# EAGLE schematic iot1 (EAGLE 9.6.2)

## Sheet 1 of 5
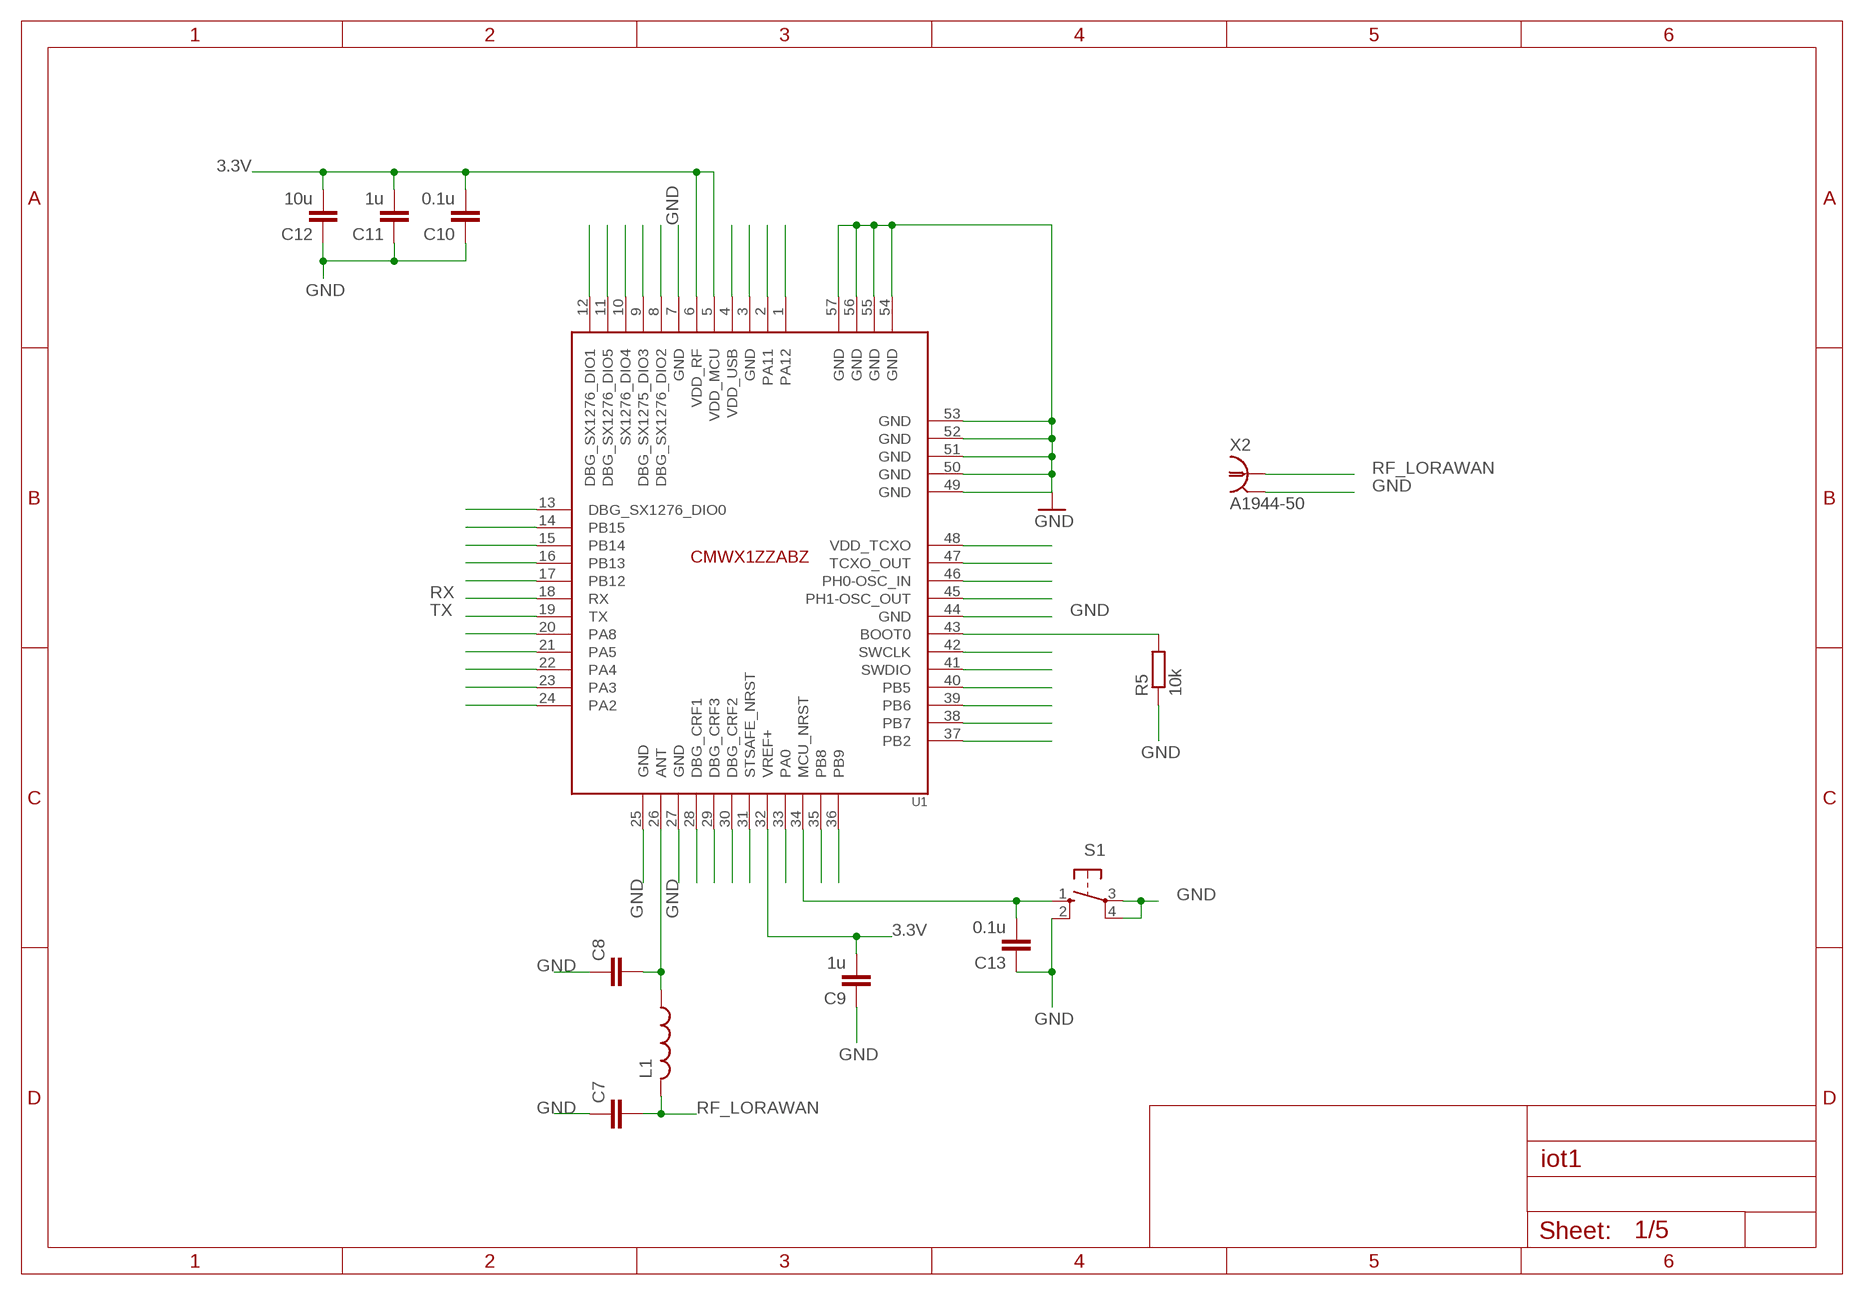
[diagram p0: schematic, sheet 1]

### Parts
C7  C-EU050-025X075  [C050-025X075]
C8  C-EU050-025X075  [C050-025X075]
C9  1u  C-EU050-025X075  [C050-025X075]
C10  0.1u  C-EU050-025X075  [C050-025X075]
C11  1u  C-EU050-025X075  [C050-025X075]
C12  10u  C-EU050-025X075  [C050-025X075]
C13  0.1u  C-EU050-025X075  [C050-025X075]
L1  L-US0207/7  [0207/7]
R5  10k  R-EU_0204/5  [0204/5]
S1  10-XX  [B3F-10XX]
U1  CMWX1ZZABZ  [CMWX1ZZABZ]
X2  A1944-50  [A1944]

### Nets
3.3V: C9.2 C10.2 C11.2 C12.2 U1.5(VDD_MCU) U1.6(VDD_RF) U1.32(VREF+) ; also sheet 2,4
GND: C7.1 C8.1 C9.1 C10.1 C11.1 C12.1 C13.1 R5.1 S1.2(S1) S1.3(P) S1.4(P1) U1.7(GND) U1.25(GND) U1.27(GND) U1.44(GND) U1.49(GND) U1.50(GND) U1.51(GND) U1.52(GND) U1.53(GND) U1.54(GND) U1.55(GND) U1.56(GND) U1.57(GND) X2.2 X2.3 X2.4 X2.5 ; also sheet 2,3,4,5
N$1: U1.12(DBG_SX1276_DIO1)
N$2: U1.11(DBG_SX1276_DIO5)
N$3: U1.10(SX1276_DIO4)
N$4: U1.9(DBG_SX1275_DIO3)
N$5: U1.8(DBG_SX1276_DIO2)
N$6: U1.4(VDD_USB)
N$10: U1.3(GND)
N$11: U1.2(PA11)
N$12: U1.1(PA12)
N$17: U1.13(DBG_SX1276_DIO0)
N$18: U1.14(PB15)
N$19: U1.15(PB14)
N$20: U1.16(PB13)
N$21: U1.17(PB12)
N$24: U1.20(PA8)
N$25: U1.21(PA5)
N$26: U1.22(PA4)
N$27: U1.23(PA3)
N$28: U1.24(PA2)
N$30: C8.2 L1.1 U1.26(ANT)
N$32: U1.28(DBG_CRF1)
N$33: U1.29(DBG_CRF3)
N$34: U1.30(DBG_CRF2)
N$35: U1.31(STSAFE_NRST)
N$37: U1.33(PA0)
N$38: C13.2 S1.1(S) U1.34(MCU_NRST)
N$39: U1.35(PB8)
N$40: U1.36(PB9)
N$46: U1.48(VDD_TCXO)
N$47: U1.47(TCXO_OUT)
N$48: U1.46(PH0-OSC_IN)
N$49: U1.45(PH1-OSC_OUT)
N$51: R5.2 U1.43(BOOT0)
N$52: U1.42(SWCLK)
N$53: U1.41(SWDIO)
N$54: U1.40(PB5)
N$55: U1.39(PB6)
N$56: U1.38(PB7)
N$57: U1.37(PB2)
RF_LORAWAN: C7.2 L1.2 X2.1
RX: U1.18(RX) ; also sheet 3
TX: U1.19(TX) ; also sheet 3

## Sheet 2 of 5
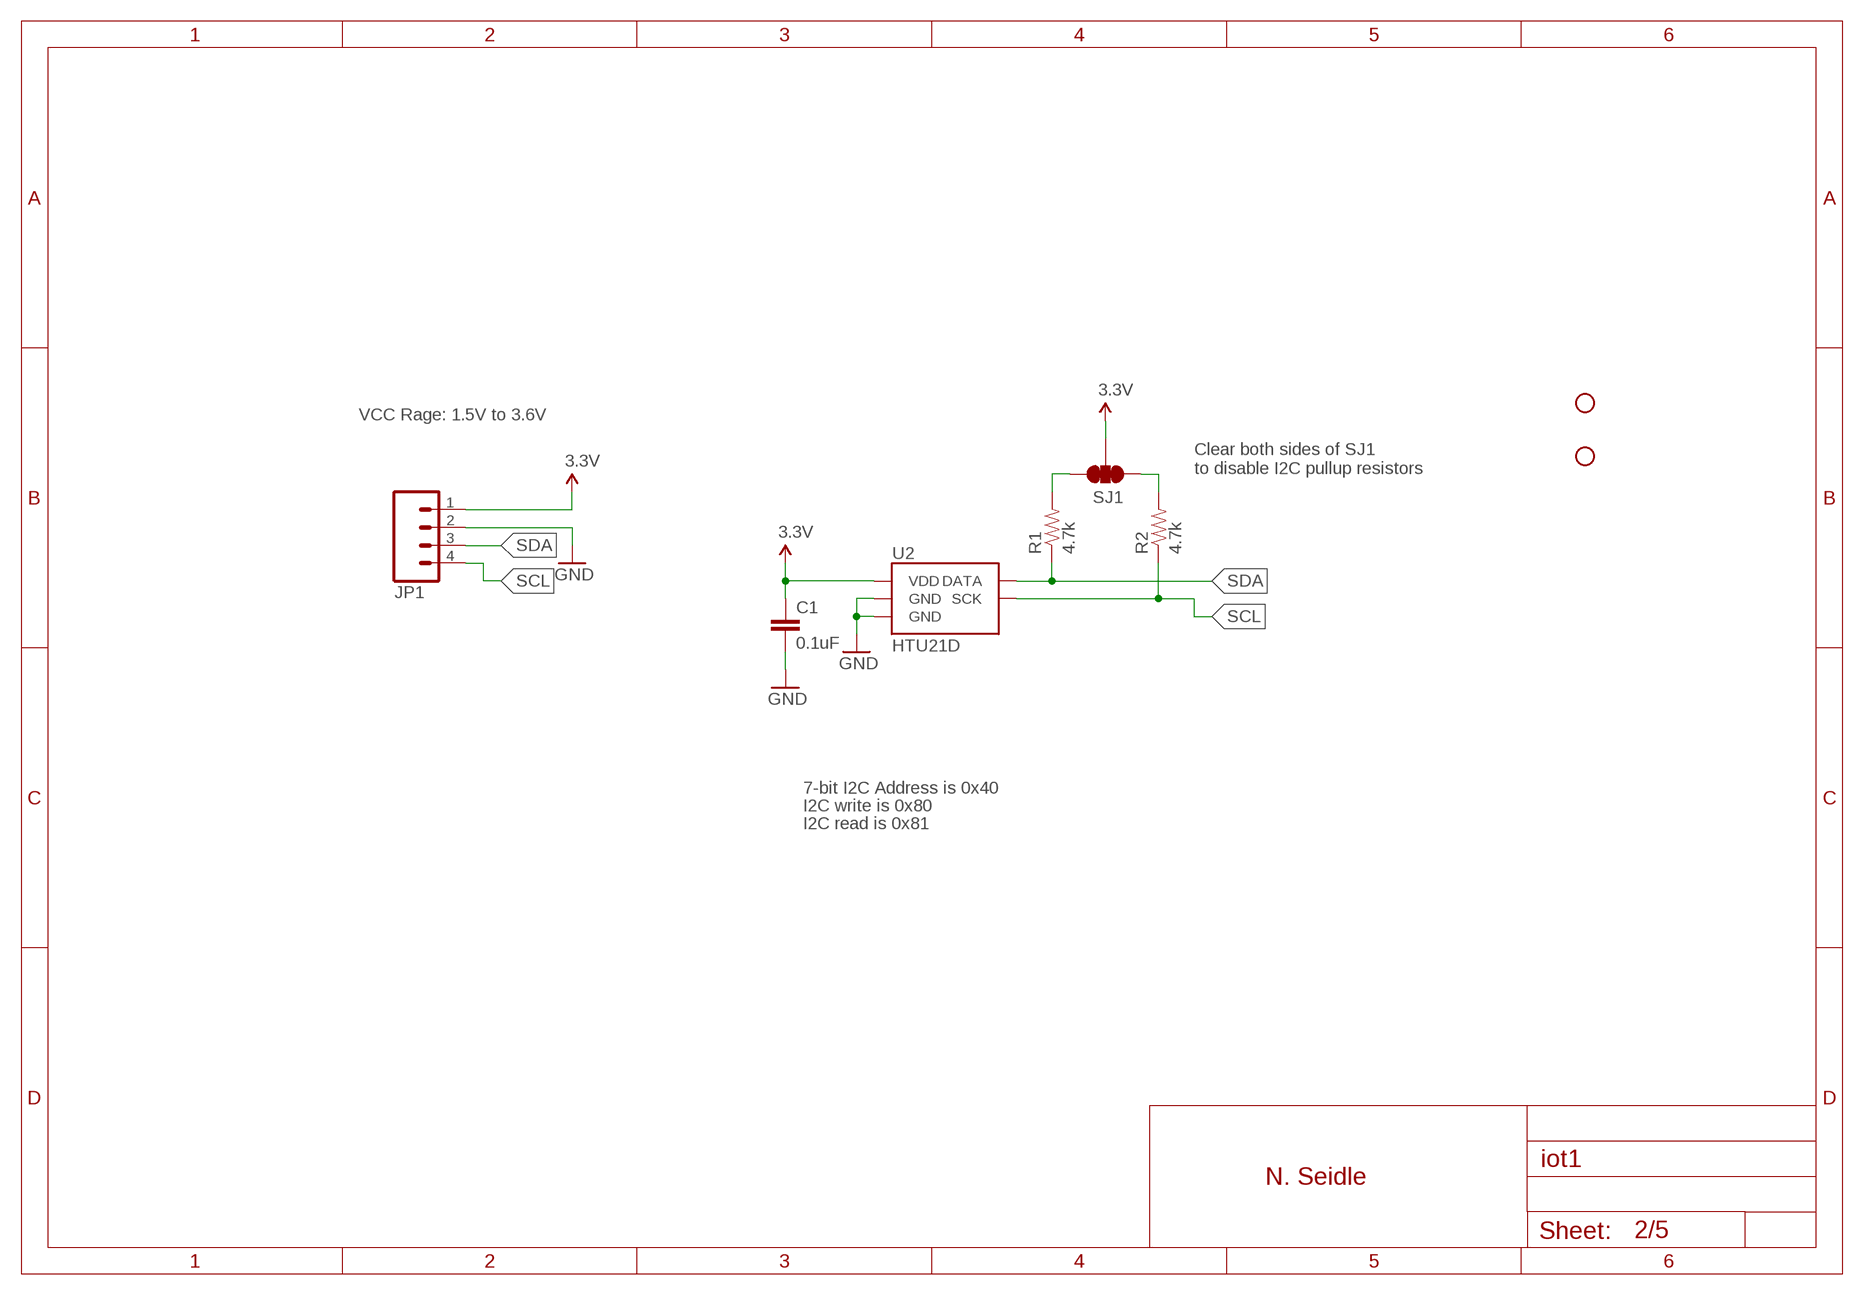
[diagram p1: schematic, sheet 2]

### Parts
C1  0.1uF  CAP0603-CAP  [0603-CAP]
JP1  M04PTH  [1X04]
R1  4.7k  RESISTOR0603-RES  [0603-RES]
R2  4.7k  RESISTOR0603-RES  [0603-RES]
SJ1  SOLDERJUMPER_2WAYPASTE1&2&3  [SJ_3_PASTE1&2&3]
STANDOFF1  STAND-OFF  [STAND-OFF]
STANDOFF2  STAND-OFF  [STAND-OFF]
U2  HTU21D  HTU21DSMD  [HTU21D]

### Nets
3.3V: C1.1 JP1.1 SJ1.2 U2.VDD ; also sheet 1,4
GND: C1.2 JP1.2 U2.7(GND) U2.GND ; also sheet 1,3,4,5
N$13: R1.2 SJ1.3
N$14: R2.2 SJ1.1
SCL: JP1.4 R2.1 U2.SCK ; also sheet 3,4
SDA: JP1.3 R1.1 U2.DATA ; also sheet 3,4

### Notes on the sheet
- VCC Rage: 1.5V to 3.6V
- Clear both sides of SJ1
  to disable I2C pullup resistors
- 7-bit I2C Address is 0x40
- I2C write is 0x80
- I2C read is 0x81
- N. Seidle

## Sheet 3 of 5
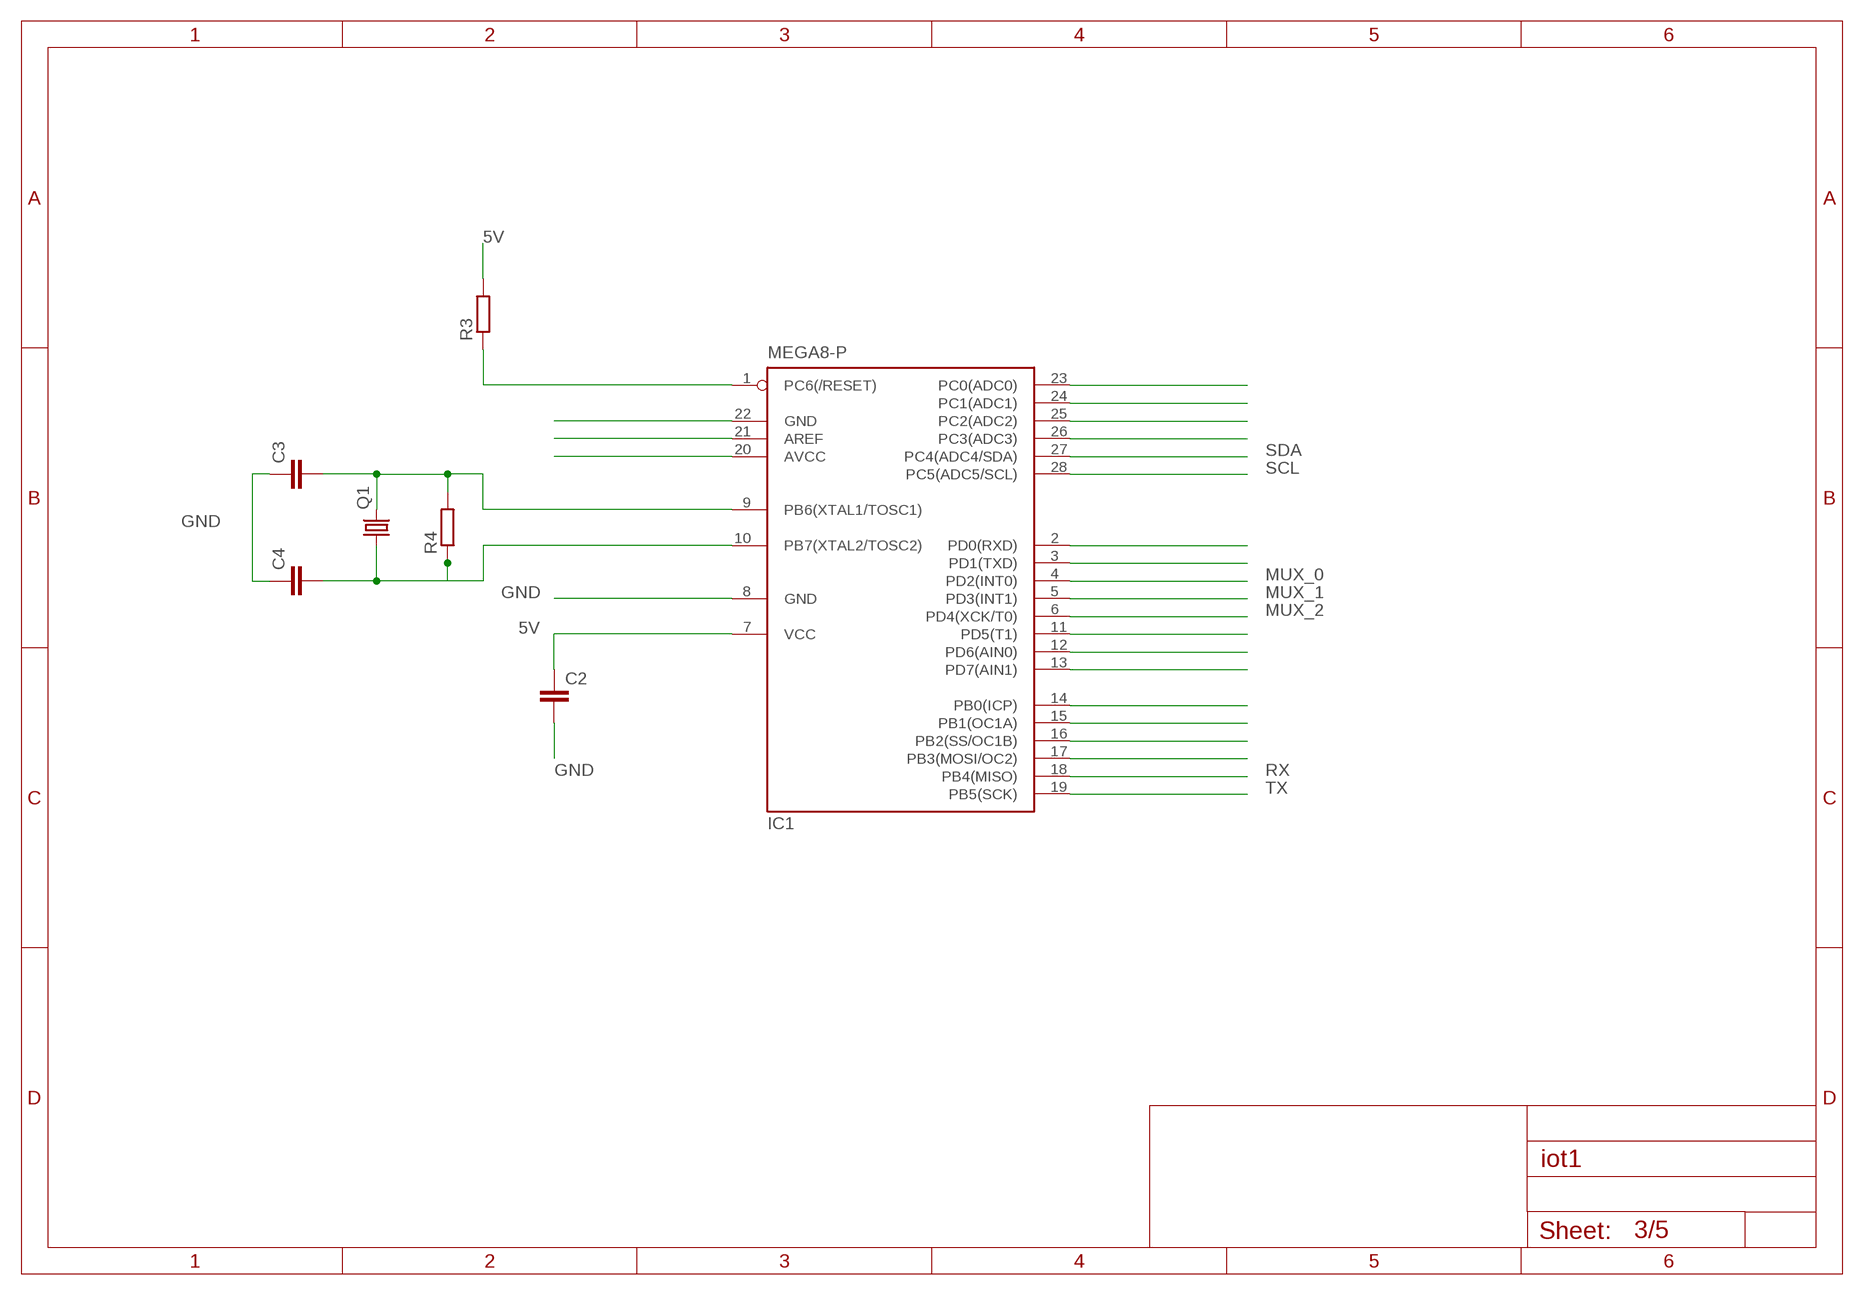
[diagram p2: schematic, sheet 3]

### Parts
C2  C-EU050-025X075  [C050-025X075]
C3  C-EU050-025X075  [C050-025X075]
C4  C-EU050-025X075  [C050-025X075]
IC1  MEGA8-P  [DIL28-3]
Q1  CRYSTALHC18U-V  [HC18U-V]
R3  R-EU_0204/7  [0204/7]
R4  R-EU_0204/7  [0204/7]

### Nets
5V: C2.1 IC1.7(VCC) R3.2 ; also sheet 4,5
GND: C2.2 C3.1 C4.1 IC1.8(GND) ; also sheet 1,2,4,5
MUX_0: IC1.4(PD2(INT0)) ; also sheet 4
MUX_1: IC1.5(PD3(INT1)) ; also sheet 4
MUX_2: IC1.6(PD4(XCK/T0)) ; also sheet 4
N$15: IC1.23(PC0(ADC0))
N$16: IC1.24(PC1(ADC1))
N$22: IC1.25(PC2(ADC2))
N$23: IC1.26(PC3(ADC3))
N$41: IC1.2(PD0(RXD))
N$42: IC1.3(PD1(TXD))
N$58: IC1.11(PD5(T1))
N$59: IC1.12(PD6(AIN0))
N$60: IC1.13(PD7(AIN1))
N$61: IC1.14(PB0(ICP))
N$62: IC1.15(PB1(OC1A))
N$63: IC1.16(PB2(SS/OC1B))
N$64: IC1.17(PB3(MOSI/OC2))
N$67: IC1.1(PC6(/RESET)) R3.1
N$68: IC1.22(GND)
N$69: IC1.21(AREF)
N$70: IC1.20(AVCC)
N$72: C4.2 IC1.10(PB7(XTAL2/TOSC2)) Q1.1 R4.1
N$73: C3.2 IC1.9(PB6(XTAL1/TOSC1)) Q1.2 R4.2
RX: IC1.18(PB4(MISO)) ; also sheet 1
SCL: IC1.28(PC5(ADC5/SCL)) ; also sheet 2,4
SDA: IC1.27(PC4(ADC4/SDA)) ; also sheet 2,4
TX: IC1.19(PB5(SCK)) ; also sheet 1

## Sheet 4 of 5
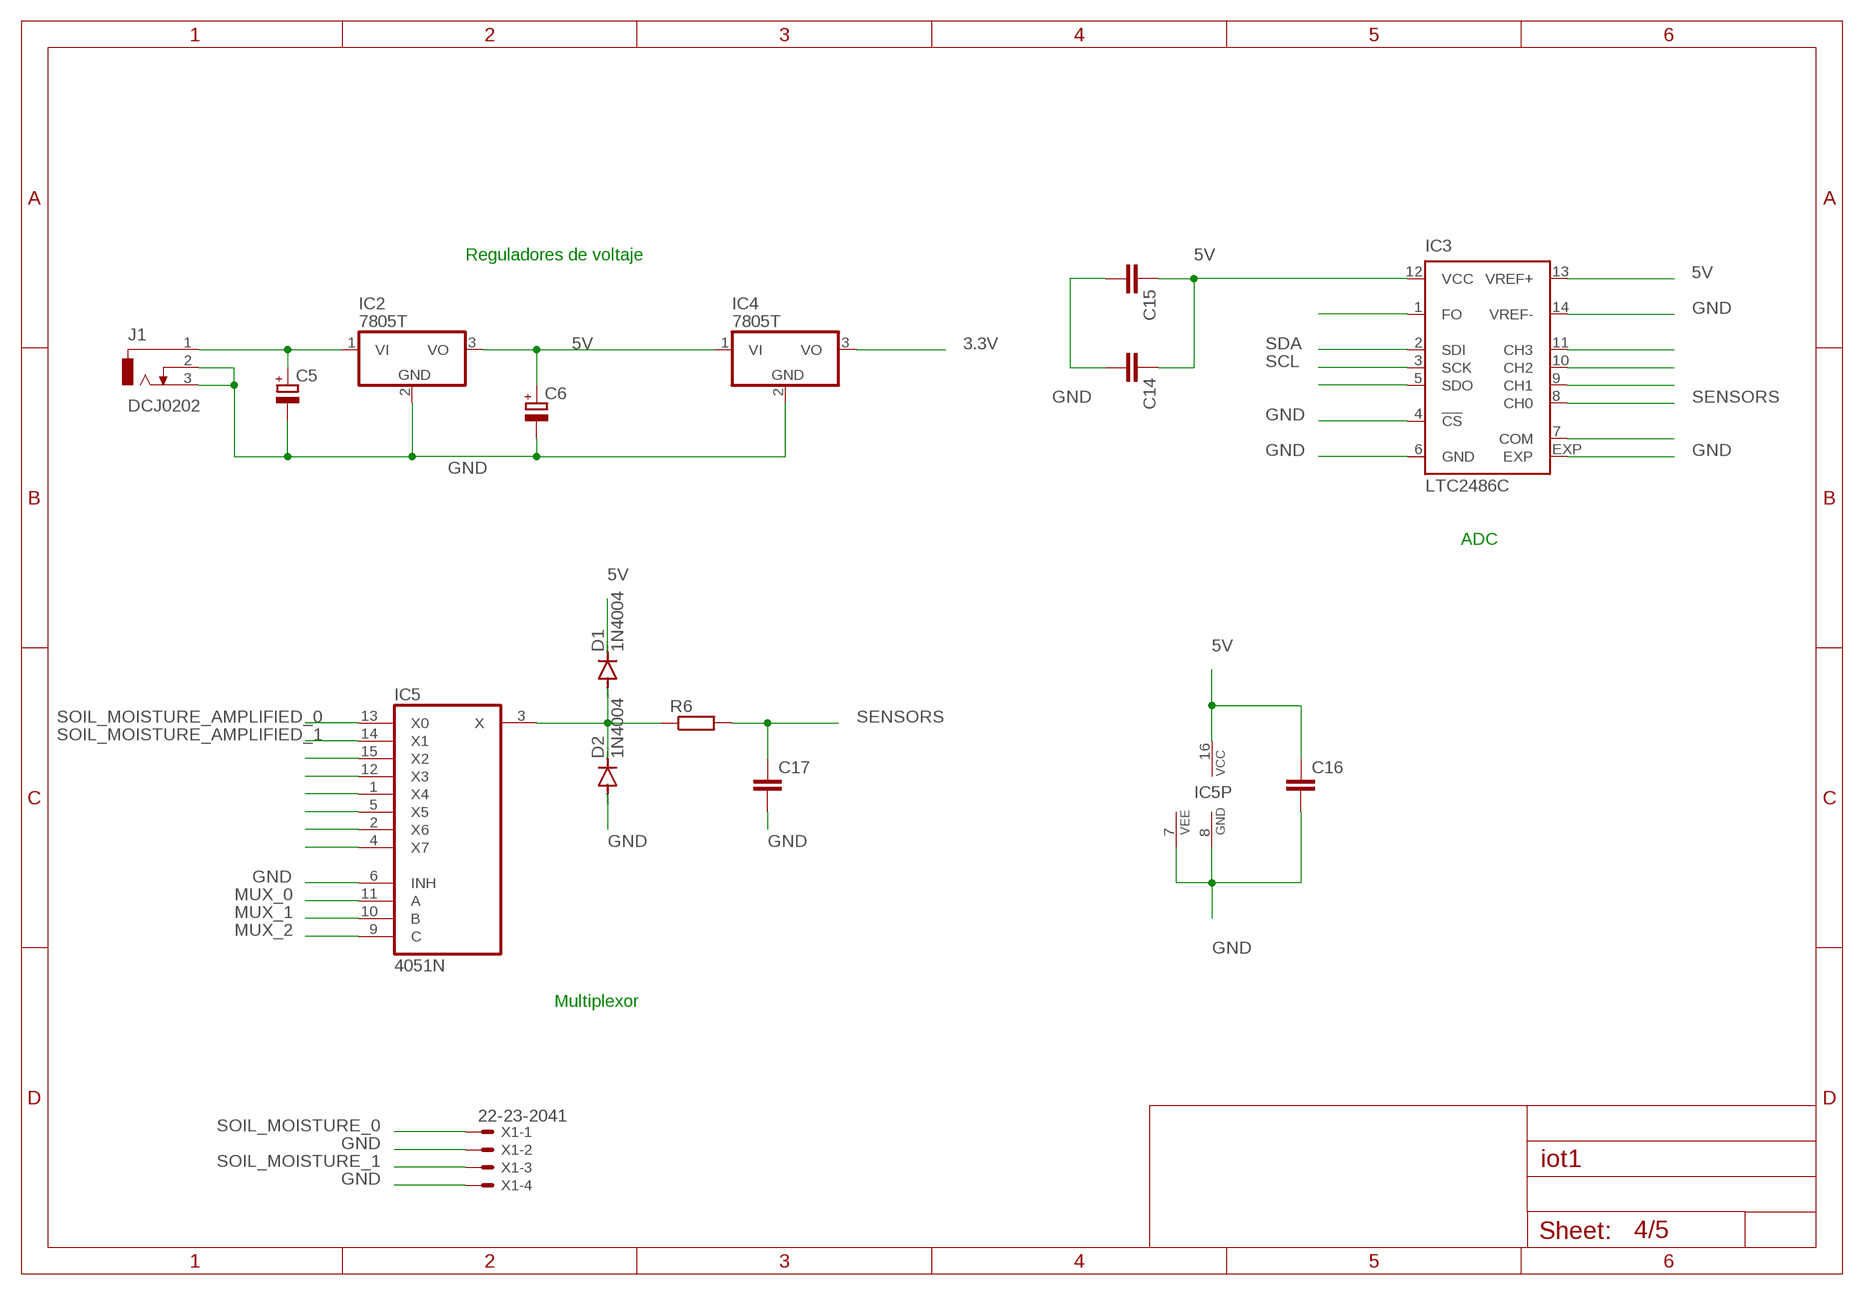
[diagram p3: schematic, sheet 4]

### Parts
C5  CPOL-EUE1.8-4  [E1,8-4]
C6  CPOL-EUE1.8-4  [E1,8-4]
C14  C-EUC0603  [C0603]
C15  C-EUC0603  [C0603]
C16  C-EUC0603  [C0603]
C17  C-EUC0603  [C0603]
D1  1N4004  [DO41-10]
D2  1N4004  [DO41-10]
IC2  7805T  [TO220H]
IC3  LTC2486C  [DFN14-4X3]
IC4  7805T  [TO220H]
IC5  4051N  [DIL16]
J1  DCJ0202  [DCJ0202]
R6  R-EU_0207/10  [0207/10]
X1  22-23-2041  [22-23-2041]

### Nets
3.3V: IC4.3(VO) ; also sheet 1,2
5V: C6.+ C14.1 C15.1 C16.1 D1.C IC2.3(VO) IC3.12(VCC) IC3.13(VREF+) IC4.1(VI) IC5.16(VCC) ; also sheet 3,5
GND: C5.- C6.- C14.2 C15.2 C16.2 C17.2 D2.A IC2.2(GND) IC3.4(!CS) IC3.6(GND) IC3.14(VREF-) IC3.EXP IC4.2(GND) IC5.6(INH) IC5.7(VEE) IC5.8(GND) J1.2 J1.3 X1.2 X1.4 ; also sheet 1,2,3,5
MUX_0: IC5.11(A) ; also sheet 3
MUX_1: IC5.10(B) ; also sheet 3
MUX_2: IC5.9(C) ; also sheet 3
N$9: IC5.15(X2)
N$29: IC5.12(X3)
N$31: IC3.5(SDO)
N$36: IC5.1(X4)
N$50: IC5.5(X5)
N$65: IC5.2(X6)
N$66: IC5.4(X7)
N$71: IC3.11(CH3)
N$74: IC3.10(CH2)
N$75: IC3.9(CH1)
N$77: IC3.7(COM)
S: D1.A D2.C IC5.3(X) R6.1
SCL: IC3.1(FO) IC3.3(SCK) ; also sheet 2,3
SDA: IC3.2(SDI) ; also sheet 2,3
SENSORS: C17.1 IC3.8(CH0) R6.2
SOIL_MOISTURE_0: X1.1 ; also sheet 5
SOIL_MOISTURE_1: X1.3 ; also sheet 5
SOIL_MOISTURE_AMPLIFIED_0: IC5.13(X0) ; also sheet 5
SOIL_MOISTURE_AMPLIFIED_1: IC5.14(X1) ; also sheet 5
V_IN: C5.+ IC2.1(VI) J1.1

### Notes on the sheet
- Reguladores de voltaje
- ADC
- Multiplexor

## Sheet 5 of 5
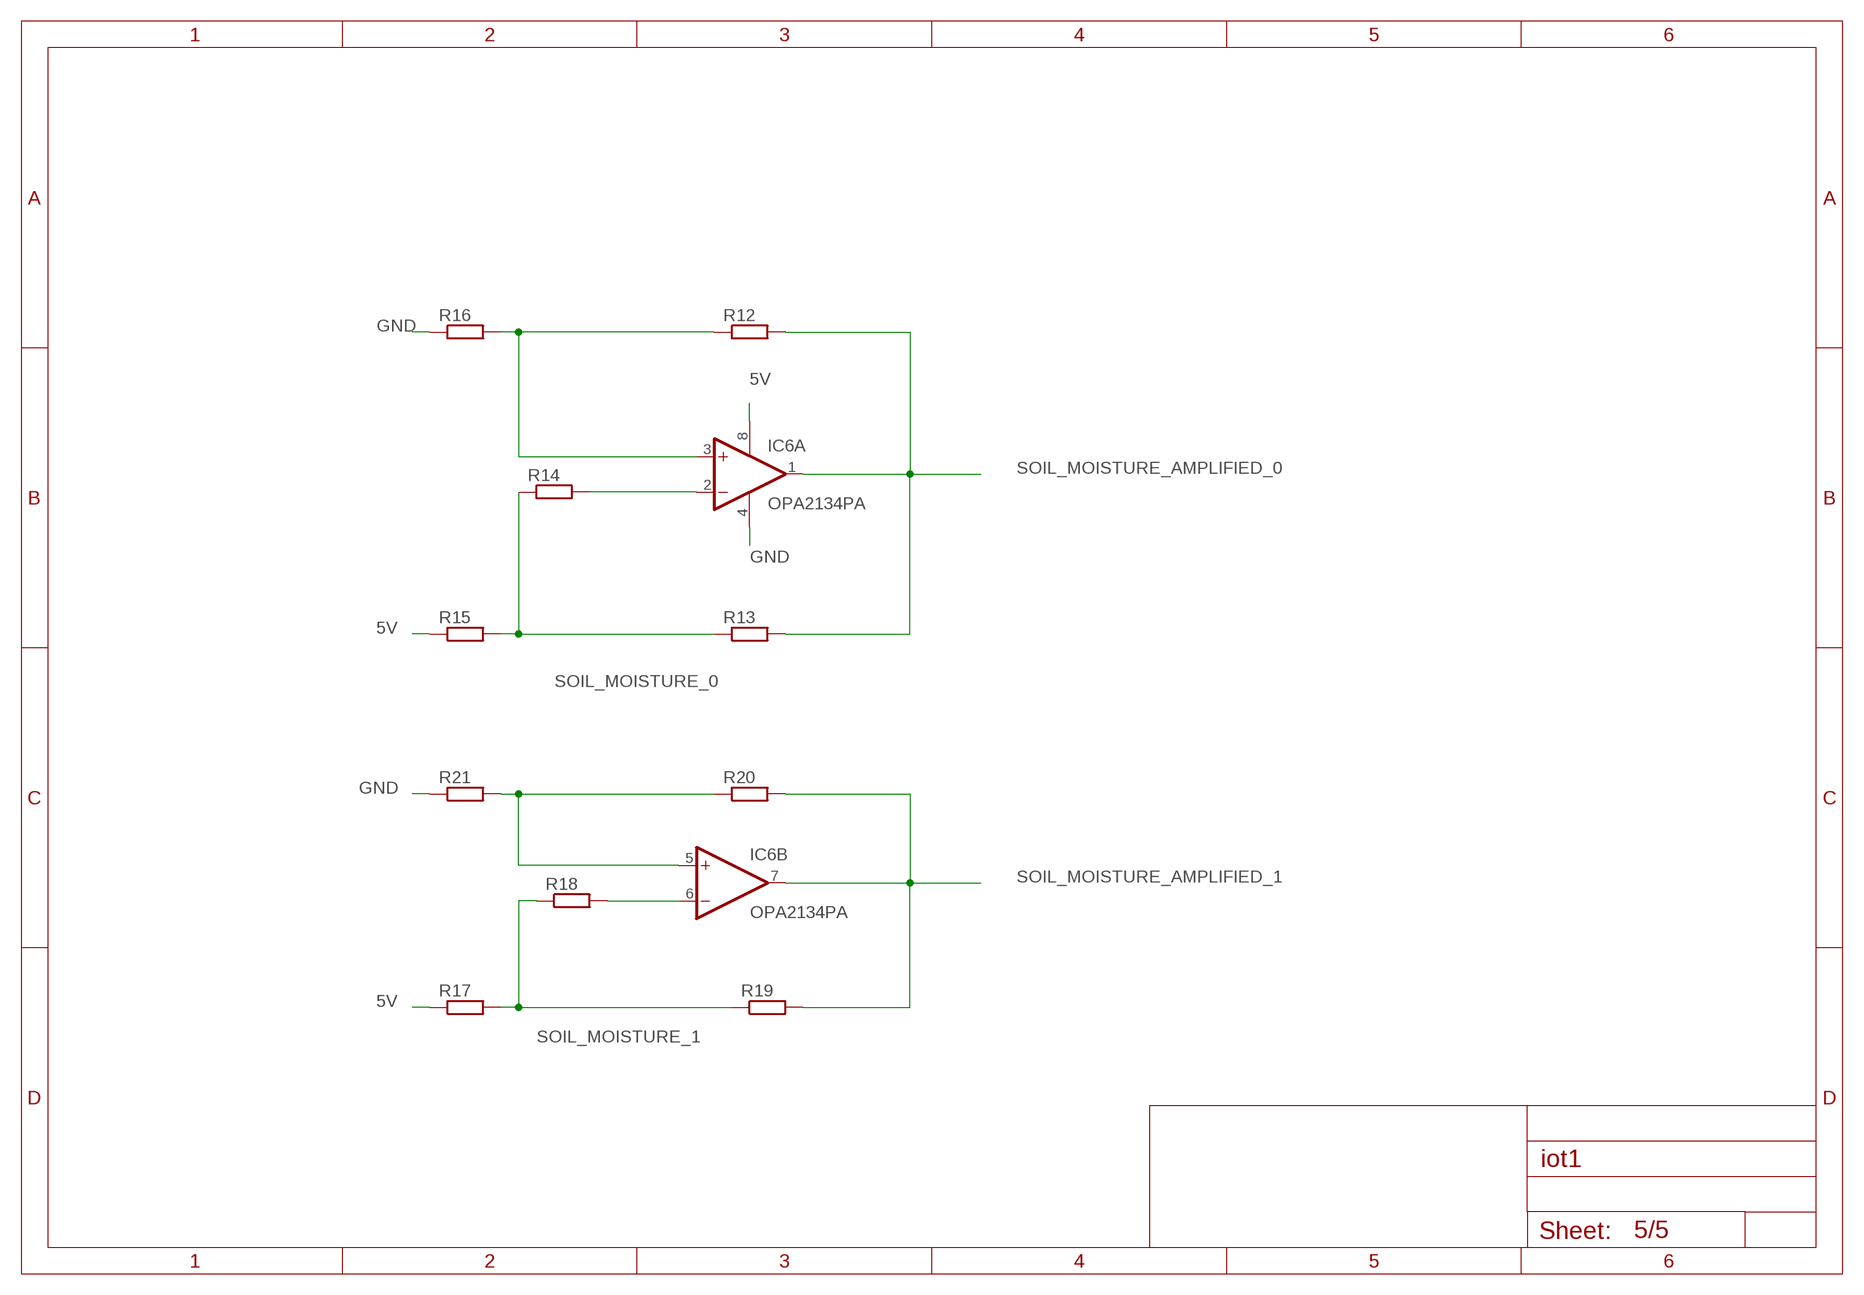
[diagram p4: schematic, sheet 5]

### Parts
IC6  OPA2134PA  [DIL08]
R12  R-EU_0207/10  [0207/10]
R13  R-EU_0207/10  [0207/10]
R14  R-EU_0207/10  [0207/10]
R15  R-EU_0207/10  [0207/10]
R16  R-EU_0207/10  [0207/10]
R17  R-EU_0207/10  [0207/10]
R18  R-EU_0207/10  [0207/10]
R19  R-EU_0207/10  [0207/10]
R20  R-EU_0207/10  [0207/10]
R21  R-EU_0207/10  [0207/10]

### Nets
5V: IC6.8(A:V+) R15.1 R17.1 ; also sheet 3,4
GND: IC6.4(A:V-) R16.1 R21.1 ; also sheet 1,2,3,4
N$78: IC6.3(A:+IN) R12.1 R16.2
N$81: IC6.2(A:-IN) R14.2
N$82: IC6.5(B:+IN) R20.1 R21.2
N$83: IC6.6(B:-IN) R18.2
SOIL_MOISTURE_0: R13.1 R14.1 R15.2 ; also sheet 4
SOIL_MOISTURE_1: R17.2 R18.1 R19.1 ; also sheet 4
SOIL_MOISTURE_AMPLIFIED_0: IC6.1(A:OUT) R12.2 R13.2 ; also sheet 4
SOIL_MOISTURE_AMPLIFIED_1: IC6.7(B:OUT) R19.2 R20.2 ; also sheet 4

## Library data of the parts
C1 = SparkFun:CAP: Capacitor Standard 0603 ceramic capacitor, and 0.1" leaded capacitor.
C2-C4 C7-C17 = rcl:C-EU: CAPACITOR, European symbol; SPICEPREFIX: C
C5 C6 = rcl:CPOL-EU: POLARIZED CAPACITOR, European symbol; SPICEPREFIX: C
D1 D2 = diode:1N4004: DIODE general purpose rectifier, 1 A
IC1 = atmel:MEGA8-P: MICROCONTROLLER 8 Kbytes FLASH, 1 kbytes SRAM, 512 bytes EEPROM, USART, 4-channel 10 bit ADC, 2-channel 8 bit ADC Pin compatible with Atmega48, ATMega88, ATMega168 Source: avr.lbr; OC_FARNELL: unknown; OC_NEWARK: unknown
IC2 IC4 = linear:78*: Positive VOLTAGE REGULATOR Source: http://cache.national.com/ds/LM/LM78L05.pdf http://www.fairchildsemi.com/ds/LM/LM7805.pdf
IC3 = linear-technology:LTC2486: 16-Bit 2-/4-Channel Delta Sigma ADC with PGA and Easy Drive Input Current Cancellation Source: http://www.linear.com/pc/downloadDocument.do?navId=H0,C1,C1155,C1001,C1152,P36532,D19318; OC_FARNELL: unknown; OC_NEWARK: unknown
IC5 = 40xx:4051: 8-channel ANALOG MULTIPLEXER
IC6 = linear:OPA2*: Dual Operational Amplifier Low Power, Single-Supply, Rail-To-Rail Operational Amplifier Source: http://focus.ti.com/lit/ds/symlink/opa2345.pdf http://focus.ti.com .. opa241.pdf http://focus.ti.com/lit/ds/symlink/opa2134.pdf
J1 = con-jack:DCJ0202: DC POWER JACK Source: DCJ0202.pdf; OC_FARNELL: unknown; OC_NEWARK: unknown
JP1 = SparkFun-Connectors:M04: Header 4 Standard 4-pin 0.1" header. Use with straight break away headers (SKU : PRT-00116), right angle break away headers (PRT-00553), swiss pins (PRT-00743), machine pins (PRT-00117), and female headers (PRT-00115). Molex polarized connector foot print use with SKU : PRT-08231 with associated crimp pins and housings. 1MM SMD Version SKU: PRT-10208
L1 = rcl:L-US: INDUCTOR, American symbol; SPICEPREFIX: L
Q1 = crystal:CRYSTAL: CRYSTAL; OC_FARNELL: unknown; OC_NEWARK: unknown
R1 R2 = SparkFun:RESISTOR: Resistor Basic schematic elements and footprints for 0603, 1206, and PTH resistors.
R3-R6 R12-R21 = rcl:R-EU_: RESISTOR, European symbol; SPICEPREFIX: R
S1 = switch-omron:10-XX: OMRON SWITCH; MPN: B3F-1000; OC_FARNELL: 176432; OC_NEWARK: 36M3542
SJ1 = mike-temp:SOLDERJUMPER_2WAY: Solder Jumper 2 way solder jumper
STANDOFF1 STANDOFF2 = SparkFun-Electromechanical:STAND-OFF: #4 Stand Off This is the mechanical footprint for a #4 phillips button head screw. Use the keepout ring to avoid running the screw head into surrounding components. SKU : PRT-00447
U1 = FaBo-LoRa:CMWX1ZZABZ
U2 = SparkFun-Sensors:HTU21D
X1 = con-molex:22-23-2041: .100" (2.54mm) Center Header - 4 Pin; MF: MOLEX; MPN: 22-23-2041; OC_FARNELL: 1462920; OC_NEWARK: 38C0355
X2 = con-coax:A1944-50: BNC CONNECTOR 50 Ohm distributor Buerklin 78F2475; OC_FARNELL: unknown; OC_NEWARK: unknown